# Altium schematic sheet 4_connection.SchDoc
size A4; SheetNumber: 4; SheetTotal: 7
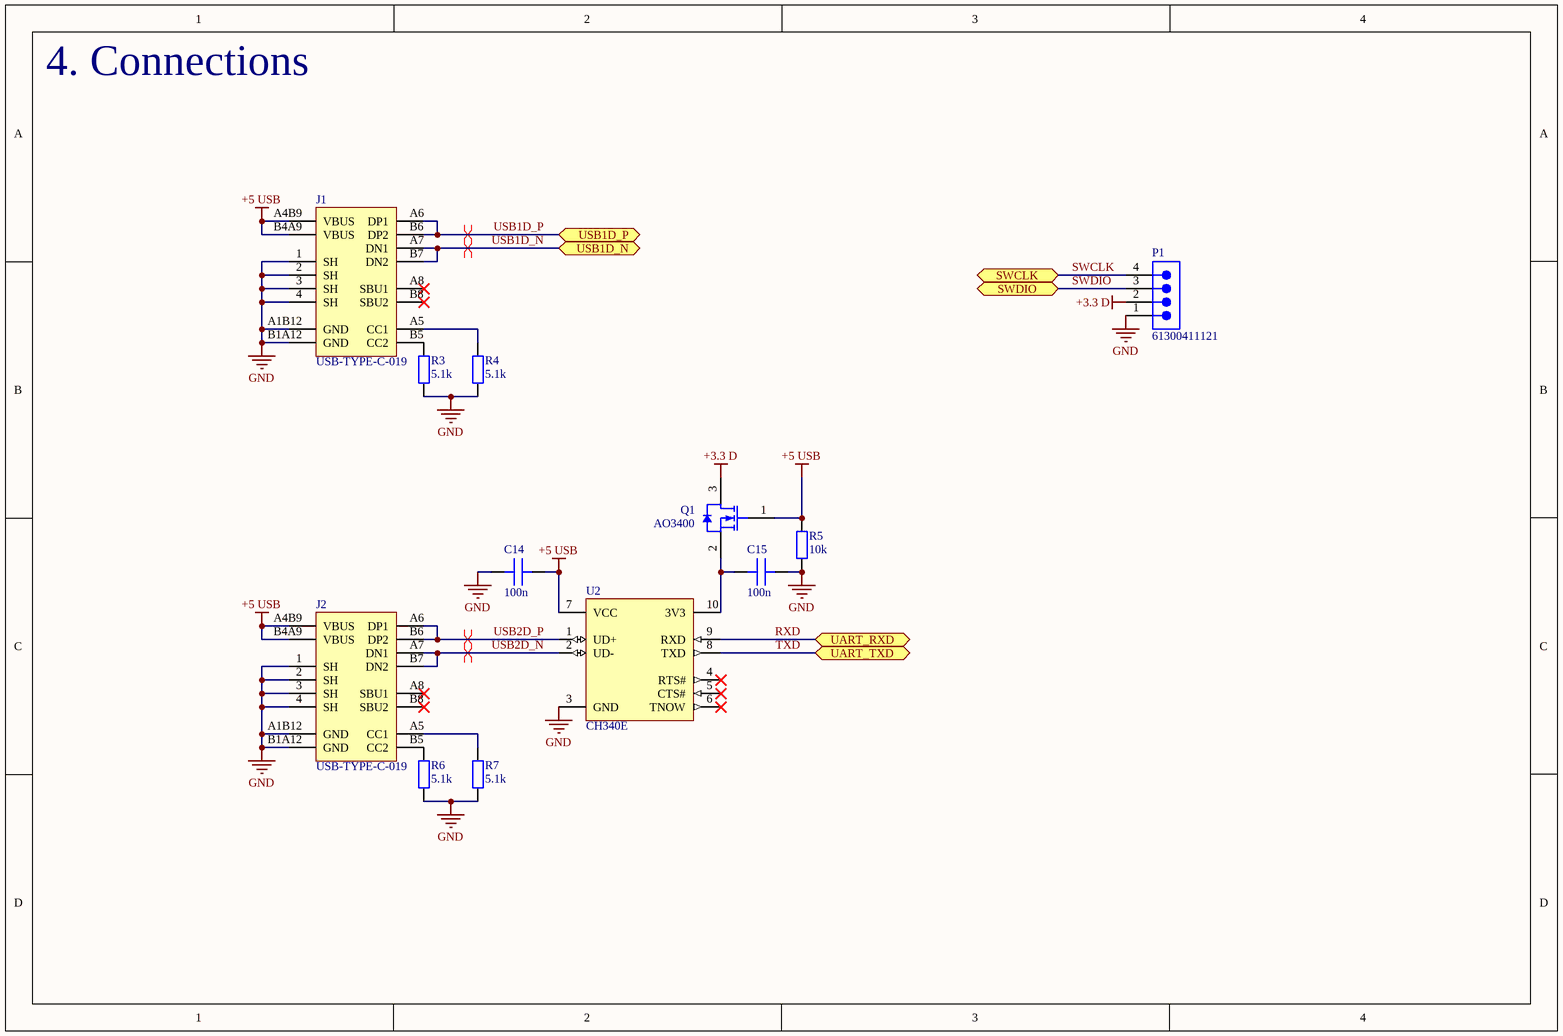
[diagram p0: 4_connection.SchDoc]

## Parts
C14  100n  [IPC C C0402 NO SILK]
C15  100n  [IPC C C0402 NO SILK]
J1  USB-TYPE-C-019  [USB-TYPE-C-12+4P]
J2  USB-TYPE-C-019  [USB-TYPE-C-12+4P]
P1  61300411121  [61300411121]
Q1  AO3400  [AO-SOT23-3_V]
R3  5.1k  [IPC C R0402 NO SILK]
R4  5.1k  [IPC C R0402 NO SILK]
R5  10k  [IPC C R0402 NO SILK]
R6  5.1k  [IPC C R0402 NO SILK]
R7  5.1k  [IPC C R0402 NO SILK]
U2  CH340E  [MSOP-UN10_L]

## Ports
SWCLK (bidir, see 2_mcu[3C]), SWDIO (bidir, see 2_mcu[3C]), UART_RXD (bidir, see 2_mcu[3C]), UART_TXD (bidir, see 2_mcu[3C]), USB1D_N (bidir, see 2_mcu[3C]), USB1D_P (bidir, see 2_mcu[3C])

## Nets
+3.3 D: P1.2 Q1.3(D)
+5 USB: C14.2 J1.A4B9(VBUS) J1.B4A9(VBUS) J2.A4B9(VBUS) J2.B4A9(VBUS) Q1.1(G) R5.2 U2.7(VCC)
GND: C14.1 C15.1 J1.1(SH) J1.2(SH) J1.3(SH) J1.4(SH) J1.A1B12(GND) J1.B1A12(GND) J2.1(SH) J2.2(SH) J2.3(SH) J2.4(SH) J2.A1B12(GND) J2.B1A12(GND) P1.1 R3.1 R4.1 R5.1 R6.1 R7.1 U2.3(GND)
RXD: U2.9(RXD) ; port UART_RXD
SWCLK: P1.4 ; port SWCLK
SWDIO: P1.3 ; port SWDIO
TXD: U2.8(TXD) ; port UART_TXD
USB1D_N: J1.A7(DN1) J1.B7(DN2) ; port USB1D_N
USB1D_P: J1.A6(DP1) J1.B6(DP2) ; port USB1D_P
USB2D_N: J2.A7(DN1) J2.B7(DN2) U2.2(UD-)
USB2D_P: J2.A6(DP1) J2.B6(DP2) U2.1(UD+)
NetC15_2: C15.2 Q1.2(S) U2.10(3V3)
NetJ1_A5: J1.A5(CC1) R4.2
NetJ1_B5: J1.B5(CC2) R3.2
NetJ2_A5: J2.A5(CC1) R7.2
NetJ2_B5: J2.B5(CC2) R6.2

Not connected (* = marked no-connect by the designer): J1 A8(SBU1)* B8(SBU2)*; J2 A8(SBU1)* B8(SBU2)*; U2 4(RTS#)* 5(CTS#)* 6(TNOW)*

## Layout directives
differential pair: USB1D_N, USB1D_P, USB2D_N, USB2D_P

## Notes on the sheet
- 4. Connections

## Library data of the parts
C14 C15 = Generic CAP 0402: Value: 100n
J1 J2 = USB-TYPE-C-019: Connector Type:Type-C Standard:- Gender:Female Number of Contacts:16 Number of Ports:1 Mounting Style:Surface Mount Current Rating - Power (Max):3A Operating Temperature Range:-25℃~+85℃ Operating Temperature Range:-25℃~+85℃; Manufacturer: DEALON(德艺隆); Add into BOM: yes; Connector Type: Type-C; Gender: Female; Number of Contacts: 16; Number of Ports: 1; Current Rating - Power (Max): 3A; Symbol: USB-TYPE-C-019; Device: USB-TYPE-C-019; LCSC Part Name: Type-C 母座 卧贴; Supplier Part: C2927039; Manufacturer Part: USB-TYPE-C-019; Supplier Footprint: SMD; JLCPCB Part Class: Extended Part; Datasheet: https://atta.szlcsc.com/upload/public/pdf/source/20211217/CCD3D517E355E8E0CC52ABD8D5784AD8.pdf; Supplier: LCSC; Convert to PCB: yes; Standard: -; Mounting Style: Surface Mount; Operating Temperature Range: -25℃~+85℃
P1 = CMP-1502-01064-2: NexarPartId: 32855522; Pitch: 2.54mm; Number of Contacts: 4; Contact Resistance: 20mΩ; Gender: Male; Current Rating: 3A; Connector Type: Male Pin; Voltage Rating: 250V; Lead Free: Lead Free; Contact Plating: Gold; Max Operating Temperature: 105°C; Packaging: Bulk; Height: 8.89mm; Orientation: Vertical; Contact Mating Length: 5.9944mm; Contact Material: Copper; Lead Pitch: 2.54mm; Min Operating Temperature: -40°C; Termination: Solder; Color: Black; Number of Rows: 1; REACH SVHC: Unknown; RoHS: Compliant; Mount: Through Hole; Number of Positions: 4; Number of Pins: 4; Operating Supply Voltage: 250V
Q1 = CMP-0278-00001-1: N-channel Enhancement Mode Field-Effect Transistor; 5.8A/30V; Manufacturer: Alpha and Omega; Channel Type: N; Drain-Source Voltage Limit: 30 V; Junction Temperature: -55 to 150 degC; Gate-Source Voltage Limit: +/-12 V; PackageDescription: 3-Pin SOT23, 3.016 x 2.8 mm Body, 0.95 mm Pitch; ComponentLink2Description: Datasheet; DatasheetVersion: Rev.8, 12/2011; ComponentLink3URL: http://www.aosmd.com/res/packaging_information/SOT-23.pdf; Storage Temperature: -55 to 150 degC; ComponentLink3Description: Package Specification; PackageReference: SOT23; ComponentLink1Description: Manufacturer URL; Mounting Technology: Surface Mount; ComponentLink1URL: http://www.aosmd.com/; PartNumber: AO3400; ComponentLink2URL: http://www.aosmd.com/res/data_sheets/AO3400.pdf
R3-R7 = Generic RES 0402
  R3 R4 R6 R7: Value: 5.1k
  R5: Value: 10k